# Altium schematic sheet TopLevel.SchDoc: Set in Document Options » Parameters » Title
size A4; Author: Set in Document Options » Parameters » Author + Contact info
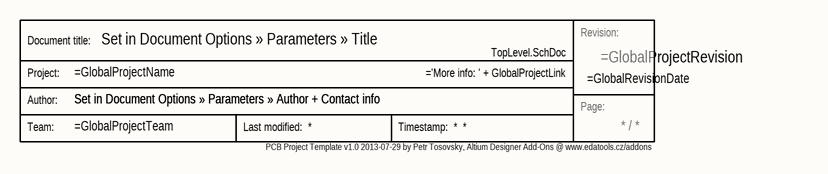
[diagram p0: TopLevel.SchDoc]

## Parts
Stamp  Stamp  (value not drawn)  (graphical)

## Notes on the sheet
- PCB Project Template v1.0 2013-07-29 by Petr Tosovsky, Altium Designer Add-Ons @ www.edatools.cz/addons <http://www.edatools.cz/addons>
- (in symbol Stamp) Revision:; Document title:; Project:; Author:; Page:; Team: